# EAGLE design v2 (EAGLE 9.6.2)
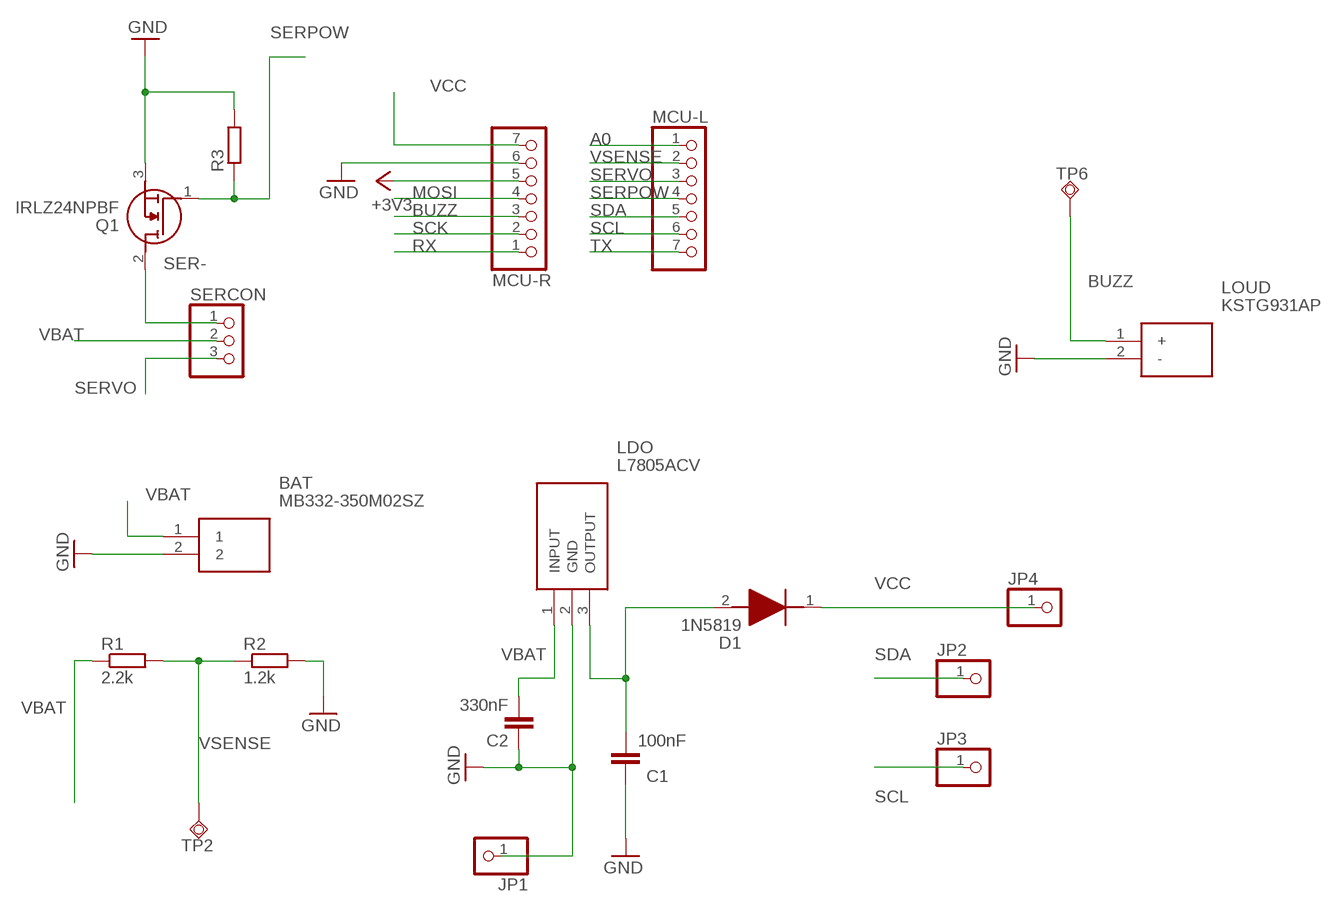
[diagram p0: schematic, sheet 1]

## Parts
BAT  MB332-350M02SZ  [MB332350M02SZ]
C1  100nF  C-EU025-024X044  [C025-024X044]
C2  330nF  C-EU025-024X044  [C025-024X044]
D1  1N5819  [DIOAD1414W86L464D238]
JP1  PINHD-1X1  [1X01]
JP2  PINHD-1X1  [1X01]
JP3  PINHD-1X1  [1X01]
JP4  PINHD-1X1  [1X01]
LDO  L7805ACV  [TO255P460X1020X2008-3P]
LOUD  KSTG931AP  [CAPPRD400W70D900H500]
MCU-L  HEADER-1X7  [1X07_OVAL]
MCU-R  HEADER-1X7  [1X07_OVAL]
Q1  IRLZ24NPBF  [TO254P469X1042X1967-3P]
R1  2.2k  R-EU_0204/2V  [0204V]
R2  1.2k  R-EU_0204/2V  [0204V]
R3  R-EU_0204/2V  [0204V]
SERCON  PINHD-1X3  [1X03]
TP2  TPSQB2,54  [B2,54]
TP6  TPSQB2,54  [B2,54]

## Nets
+3V3: MCU-R.5
A0: MCU-L.1
BUZZ: LOUD.1(+) MCU-R.3 TP6.TP
GND [power]: BAT.2 C1.1 C2.1 JP1.1 LDO.2(GND) LOUD.2(-) MCU-R.6 Q1.3(S) R2.2 R3.2
MOSI: MCU-R.4
RX: MCU-R.1
SCK: MCU-R.2
SCL: JP3.1 MCU-L.6
SDA: JP2.1 MCU-L.5
SER- [power]: Q1.2(D) SERCON.1
SERPOW: MCU-L.4 Q1.1(G) R3.1
SERVO: MCU-L.3 SERCON.3
TX: MCU-L.7
VBAT: BAT.1 C2.2 LDO.1(INPUT) R1.1 SERCON.2
VCC [power]: D1.1(K) JP4.1 MCU-R.7
VOUT [power]: C1.2 D1.2(A) LDO.3(OUTPUT)
VSENSE: MCU-L.2 R1.2 R2.1 TP2.TP

## Library data of the parts
BAT = SamacSys_Parts:MB332-350M02SZ: RS PRO 3.5mm Pitch Straight, PCB Terminal Block, Through Hole, 2 Way Source: Datasheet; DESCRIPTION: RS PRO 3.5mm Pitch Straight, PCB Terminal Block, Through Hole, 2 Way; HEIGHT: 12.76mm; MANUFACTURER_NAME: RS Components; MANUFACTURER_PART_NUMBER: MB332-350M02SZ; RS_PART_NUMBER: 7901149; RS_PRICE-STOCK: https://uk.rs-online.com/web/p/products/7901149
C1 C2 = rcl:C-EU: CAPACITOR, European symbol; SPICEPREFIX: C
D1 = SamacSys_Parts:1N5819: Schottky barrier diode,1N58191A 40V STMicroelectronics 1N5819, Schottky Diode, 40V 1A, 2-Pin DO-204AL Source: Datasheet <http://uk.rs-online.com/web/p/products/4864460P>; ALLIED_NUMBER: 70013816; DESCRIPTION: Schottky barrier diode,1N58191A 40V STMicroelectronics 1N5819, Schottky Diode, 40V 1A, 2-Pin DO-204AL; HEIGHT: mm; MANUFACTURER_NAME: STMicroelectronics; MANUFACTURER_PART_NUMBER: 1N5819; RS_PART_NUMBER: 4864460P; RS_PRICE-STOCK: http://uk.rs-online.com/web/p/products/4864460P
JP1-JP4 = pinhead:PINHD-1X1: PIN HEADER
LDO = SamacSys_Parts:L7805ACV: Linear voltage regulator,L7805ACV 5V 1A STMicroelectronics L7805ACV, Single Linear Voltage Regulator, 1A 5 V, 2%, 3-Pin TO-220 Source: Datasheet <http://uk.rs-online.com/web/p/products/2988508P>; ALLIED_NUMBER: 70013701; DESCRIPTION: Linear voltage regulator,L7805ACV 5V 1A STMicroelectronics L7805ACV, Single Linear Voltage Regulator, 1A 5 V, 2%, 3-Pin TO-220; HEIGHT: 4.6mm; MANUFACTURER_NAME: STMicroelectronics; MANUFACTURER_PART_NUMBER: L7805ACV; RS_PART_NUMBER: 2988508P; RS_PRICE-STOCK: http://uk.rs-online.com/web/p/products/2988508P
LOUD = SamacSys_Parts:KSTG931AP: RS PRO 4V Electromagnetic Buzzer, 92dB Source: Datasheet; DESCRIPTION: RS PRO 4V Electromagnetic Buzzer, 92dB; HEIGHT: 5mm; MANUFACTURER_NAME: RS Components; MANUFACTURER_PART_NUMBER: KSTG931AP
MCU-L MCU-R = microbuilder:HEADER-1X7: PIN HEADER
Q1 = SamacSys_Parts:IRLZ24NPBF: MOSFET MOSFT 55V 18A 60mOhm 10nC LogLvlAB Source: Datasheet <http://uk.rs-online.com/web/p/products/5411231P>; ALLIED_NUMBER: 70017119; DESCRIPTION: MOSFET MOSFT 55V 18A 60mOhm 10nC LogLvlAB; HEIGHT: 4.69mm; MANUFACTURER_NAME: Infineon; MANUFACTURER_PART_NUMBER: IRLZ24NPBF; RS_PART_NUMBER: 5411231P; RS_PRICE-STOCK: http://uk.rs-online.com/web/p/products/5411231P
R1-R3 = rcl:R-EU_: RESISTOR, European symbol; SPICEPREFIX: R
SERCON = pinhead:PINHD-1X3: PIN HEADER
TP2 TP6 = testpad:TPSQ: Test pad

## Net classes
1 power: width 0.305 mm

## Board
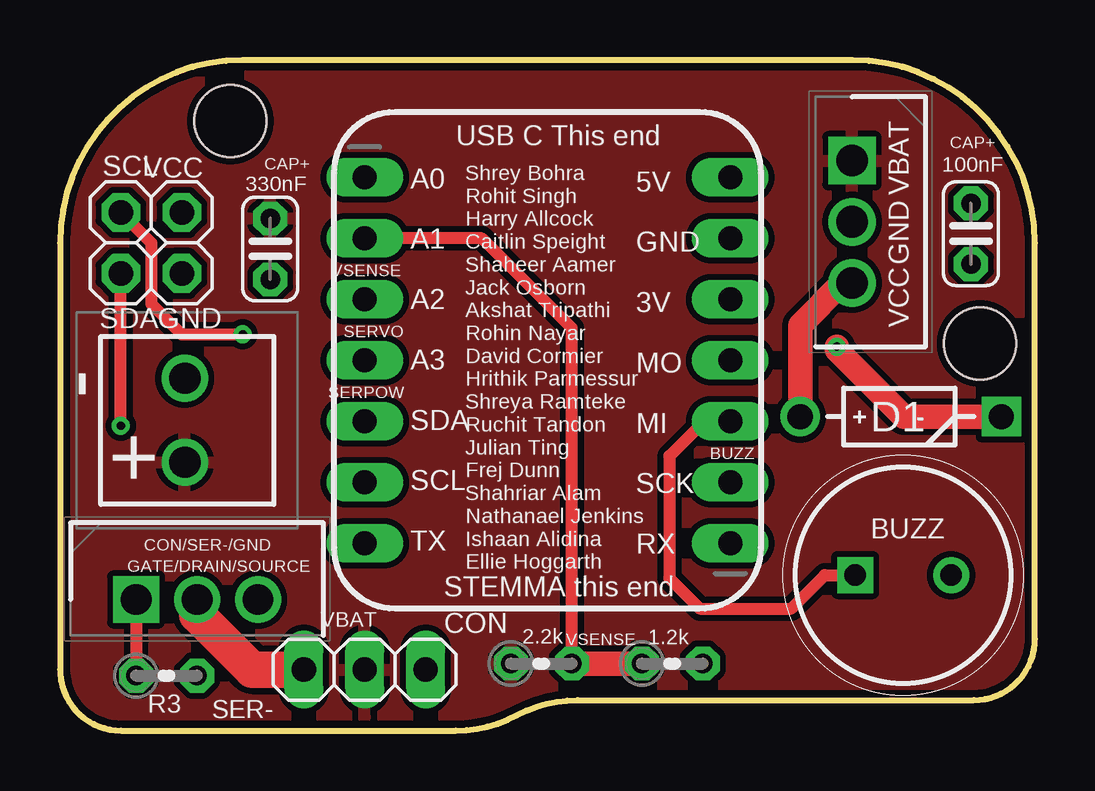
[diagram p1: board, top side]
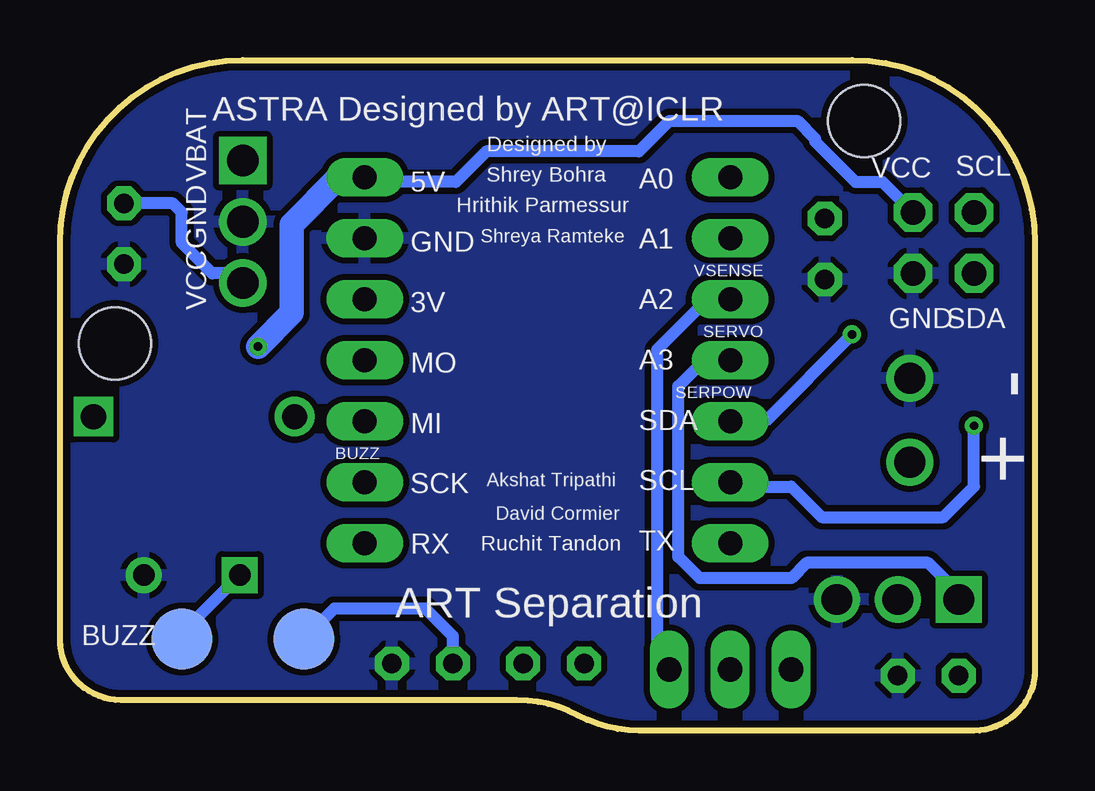
[diagram p2: board, bottom side, seen from below]

Size 40.64 x 27.94 mm. Coordinates in mm from the lower left corner, seen from the top.
Outline: 7.62,27.94 arc90 0,20.32 0,2.54 arc90 2.54,0 16.51,0 arc28 19.05,0.64 arc-28 21.59,1.27 38.1,1.27 arc90 40.64,3.81 40.64,20.32 arc90 33.02,27.94 7.62,27.94
Copper layers (1*16): Top 0.035mm / dielectric 1.5mm / Bottom 0.035mm
Design rules "aisler_2_layer_simple *": minimum track width 0.1mm, minimum drill 0.3mm, track to track 0.1mm, track to pad 0.1mm, pad to pad 0.1mm, via to via 0.1mm, smd to smd 0.1mm, copper to edge 0.3mm, drill to drill 0.25mm, minimum pad ring 0.3mm, minimum via ring 0.2mm, stop-mask expansion 0mil, vias tented up to drill 0mil, thermal gap 10mil
Holes 3 mm at 7.11,25.4 38.35,16.13

### Footprints (pad centres in the part's own frame; a part is rotated, then mirrored left to right if it is on the bottom)
MB332350M02SZ = drill 1.3 pad 1.95: 1 0,0; 2 3.5,0
C025-024X044 = drill 0.813 octagon: 1 -1.27,0; 2 1.27,0
DIOAD1414W86L464D238 = drill 1.05 pad 1.575 square: 1 2.794,0 | drill 1.05 pad 1.575: 2 11.179,0
1X01 = drill 1.016 octagon: 1 0,0
TO255P460X1020X2008-3P = drill 1.32 pad 1.98 square: 1 0,0 | drill 1.32 pad 1.98: 2 2.55,0; 3 5.1,0
CAPPRD400W70D900H500 = drill 0.9 pad 1.35 square: 1 0,0 | drill 0.9 pad 1.35: 2 4,0
1X07_OVAL = drill 1 long: 1 -7.62,0; 2 -5.08,0; 3 -2.54,0; 4 0,0; 5 2.54,0; 6 5.08,0; 7 7.62,0
TO254P469X1042X1967-3P = drill 1.28 pad 1.92 square: 1 0,0 | drill 1.28 pad 1.92: 2 2.54,0; 3 5.08,0
0204V = drill 0.813 octagon: 1 -1.27,0; 2 1.27,0
1X03 = drill 1.016 long: 1 -2.54,0; 2 0,0; 3 2.54,0
B2,54 = smd 2.54 x 2.54: TP 0,0

### Placement (x,y rotation side)
BAT  5.21,11.18 90 top
C1  37.97,20.7 90 top
C2  8.76,20.07 90 top
D1  42.04,13.08 180 top
JP1  5.08,19.05 0 top
JP2  2.54,21.59 0 top
JP3  2.54,19.05 0 top
JP4  5.08,21.59 0 top
LDO  33.02,23.75 270 top
LOUD  33.15,6.48 0 top
MCU-L  12.7,15.43 270 top
MCU-R  27.94,15.43 90 top
Q1  3.18,5.46 0 top
R1  20.07,2.79 0 top
R2  25.53,2.79 0 top
R3  4.45,2.29 0 top
SERCON  12.7,2.54 0 top
TP2  30.48,3.81 180 bottom
TP6  35.56,3.81 0 bottom

### Tracks (layer width: path | path; a pad name or v marks a point on that pad's centre or on a via)
BUZZ
  Top 0.508: MCU-R.3 27.75,12.7 26.67,12.7 25.4,11.43 25.4,6.35 26.67,5.08 30.48,5.08 31.88,6.48 LOUD.1
  Bottom 0.508: LOUD.1 35.56,4.06 TP6.TP
GND
  pour Bottom (isolate 0.254): -5.08,27.94 0,33.02 39.37,33.02 45.72,26.67 45.72,1.27 45.72,-1.27 41.91,-5.08 0,-5.08 -1.27,-5.08 -6.35,0 -6.35,26.67
SCL  (via drill 0.35)
  Top 0.508: v2.54,12.7 JP3.1
  Bottom 0.508: MCU-L.6 12.51,10.16 10.16,10.16 8.89,8.89 3.81,8.89 2.54,10.16 v2.54,12.7
SDA  (via drill 0.35)
  Top 0.508: JP2.1 3.81,20.32 3.81,17.78 5.08,16.51 v7.62,16.51
  Bottom 0.508: MCU-L.5 11.24,12.89 v7.62,16.51
SER-
  Top 1.524: Q1.2 5.71,4.83 8,2.54 SERCON.1
SERPOW
  Top 0.508: Q1.1 R3.1
  Bottom 0.508: Q1.1 3.18,5.71 4.45,6.99 9.53,6.99 10.16,6.35 13.97,6.35 14.86,7.24 14.86,14.35 13.78,15.43 MCU-L.4
SERVO
  Bottom 0.508: MCU-L.3 13.65,17.97 15.75,15.88 15.75,3.05 SERCON.3
VBAT
  pour Top (isolate 0.254): 0,30.48 -2.54,27.94 -2.54,1.27 -2.54,0 0,-2.54 39.37,-2.54 43.18,1.27 43.18,25.4 38.1,30.48 33.02,30.48
VCC  (via drill 0.35)
  Top 1.016: D1.1 35.18,13.08 32.38,15.88 v32.38,16
  Bottom 0.508: MCU-R.7 27.75,22.86 24.13,22.86 22.86,24.13 16.51,24.13 15.24,25.4 9.91,25.4 9.17,24.66 9.17,24.55 7.48,22.86 6.35,22.86 JP4.1
  Bottom 1.016: v32.38,16 30.99,17.4 30.99,21.08 29.02,23.05 MCU-R.7
VOUT
  Top 1.016: D1.2 30.86,16.89 32.62,18.65 LDO.3
  Bottom 0.508: LDO.3 33.42,19.05 34.29,19.05 35.56,20.32 35.56,21.59 35.94,21.97 C1.2
VSENSE
  Top 0.508: R1.2 21.34,16.76 17.59,20.51 MCU-L.2
  Top 1.016: R1.2 R2.1
  Bottom 0.508: R2.1 24.26,3.94 25.4,5.08 29.21,5.08 TP2.TP

### Text on the board
tPlace: VBAT | USB C This end | CAP+ | SCL | VCC | CAP+ | GND | VSENSE | VCC | SDA | GND | SERVO | SERPOW | - | + - | BUZZ | + | CON/SER-/GND | A0 / / A1 / / A2 / / A3 / / SDA / / SCL / / TX | 5V / / GND / / 3V / / MO / / MI / / SCK / / RX | BUZZ | GATE/DRAIN/SOURCE | Shrey Bohra / Rohit Singh / Harry Allcock / Caitlin Speight / Shaheer Aamer / Jack Osborn / Akshat Tripathi / Rohin Nayar / David Cormier / Hrithik Parmessur / Shreya Ramteke / Ruchit Tandon / Julian Ting / Frej Dunn / Shahriar Alam / Nathanael Jenkins / Ishaan Alidina / Ellie Hoggarth | STEMMA this end | VBAT | CON | VSENSE | SER-
bPlace: ASTRA Designed by ART@ICLR | Designed by | SCL | VCC | Shrey Bohra | VBAT | Hrithik Parmessur | Shreya Ramteke | GND | VSENSE | VCC | SDA | GND | SERVO | SERPOW | - | BUZZ | + | Akshat Tripathi | David Cormier | A0 / / A1 / / A2 / / A3 / / SDA / / SCL / / TX | Ruchit Tandon | 5V / / GND / / 3V / / MO / / MI / / SCK / / RX | ART Separation | BUZZ